# EAGLE schematic Full Schematic (EAGLE 6.5.0)
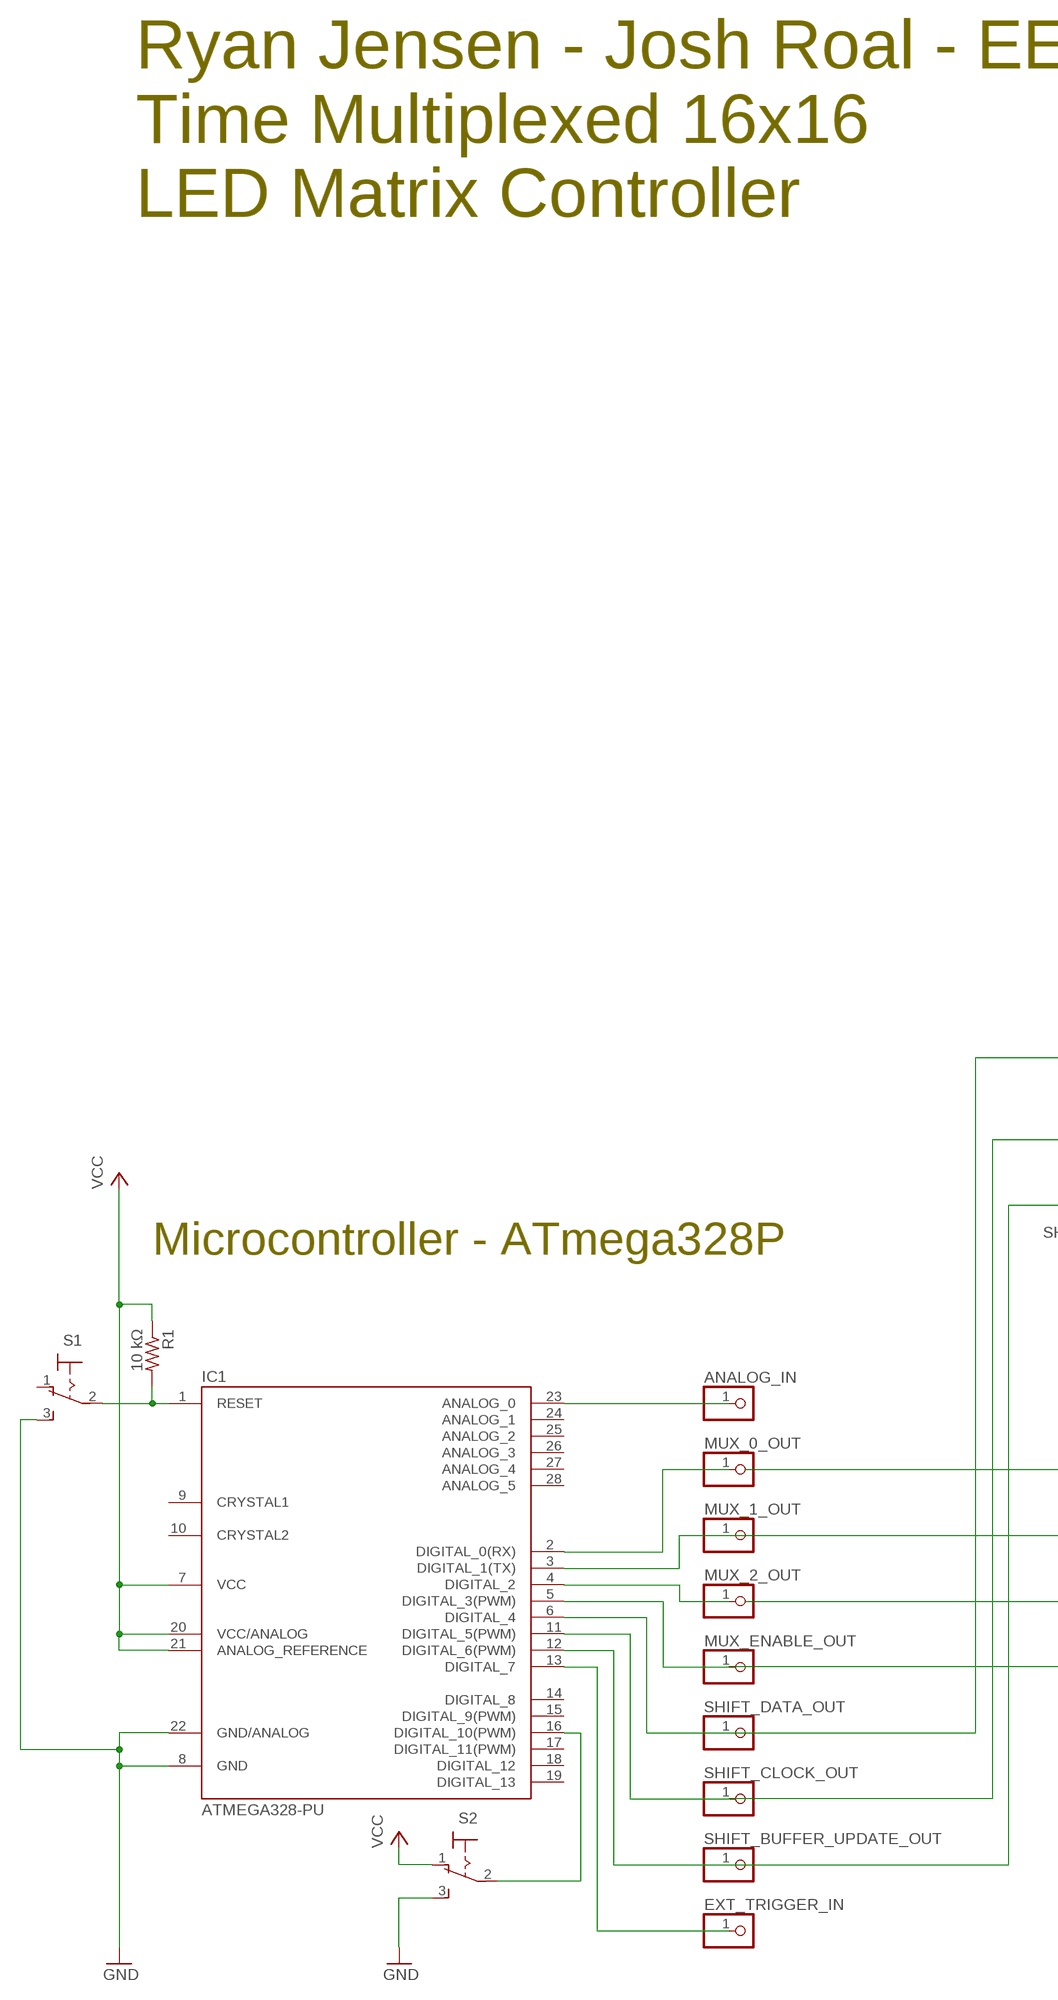
[diagram p0: schematic, sheet 1, part 1 of 3]
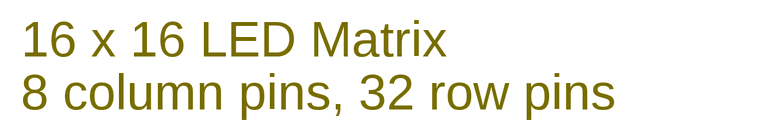
[diagram p1: schematic, sheet 1, part 2 of 3]
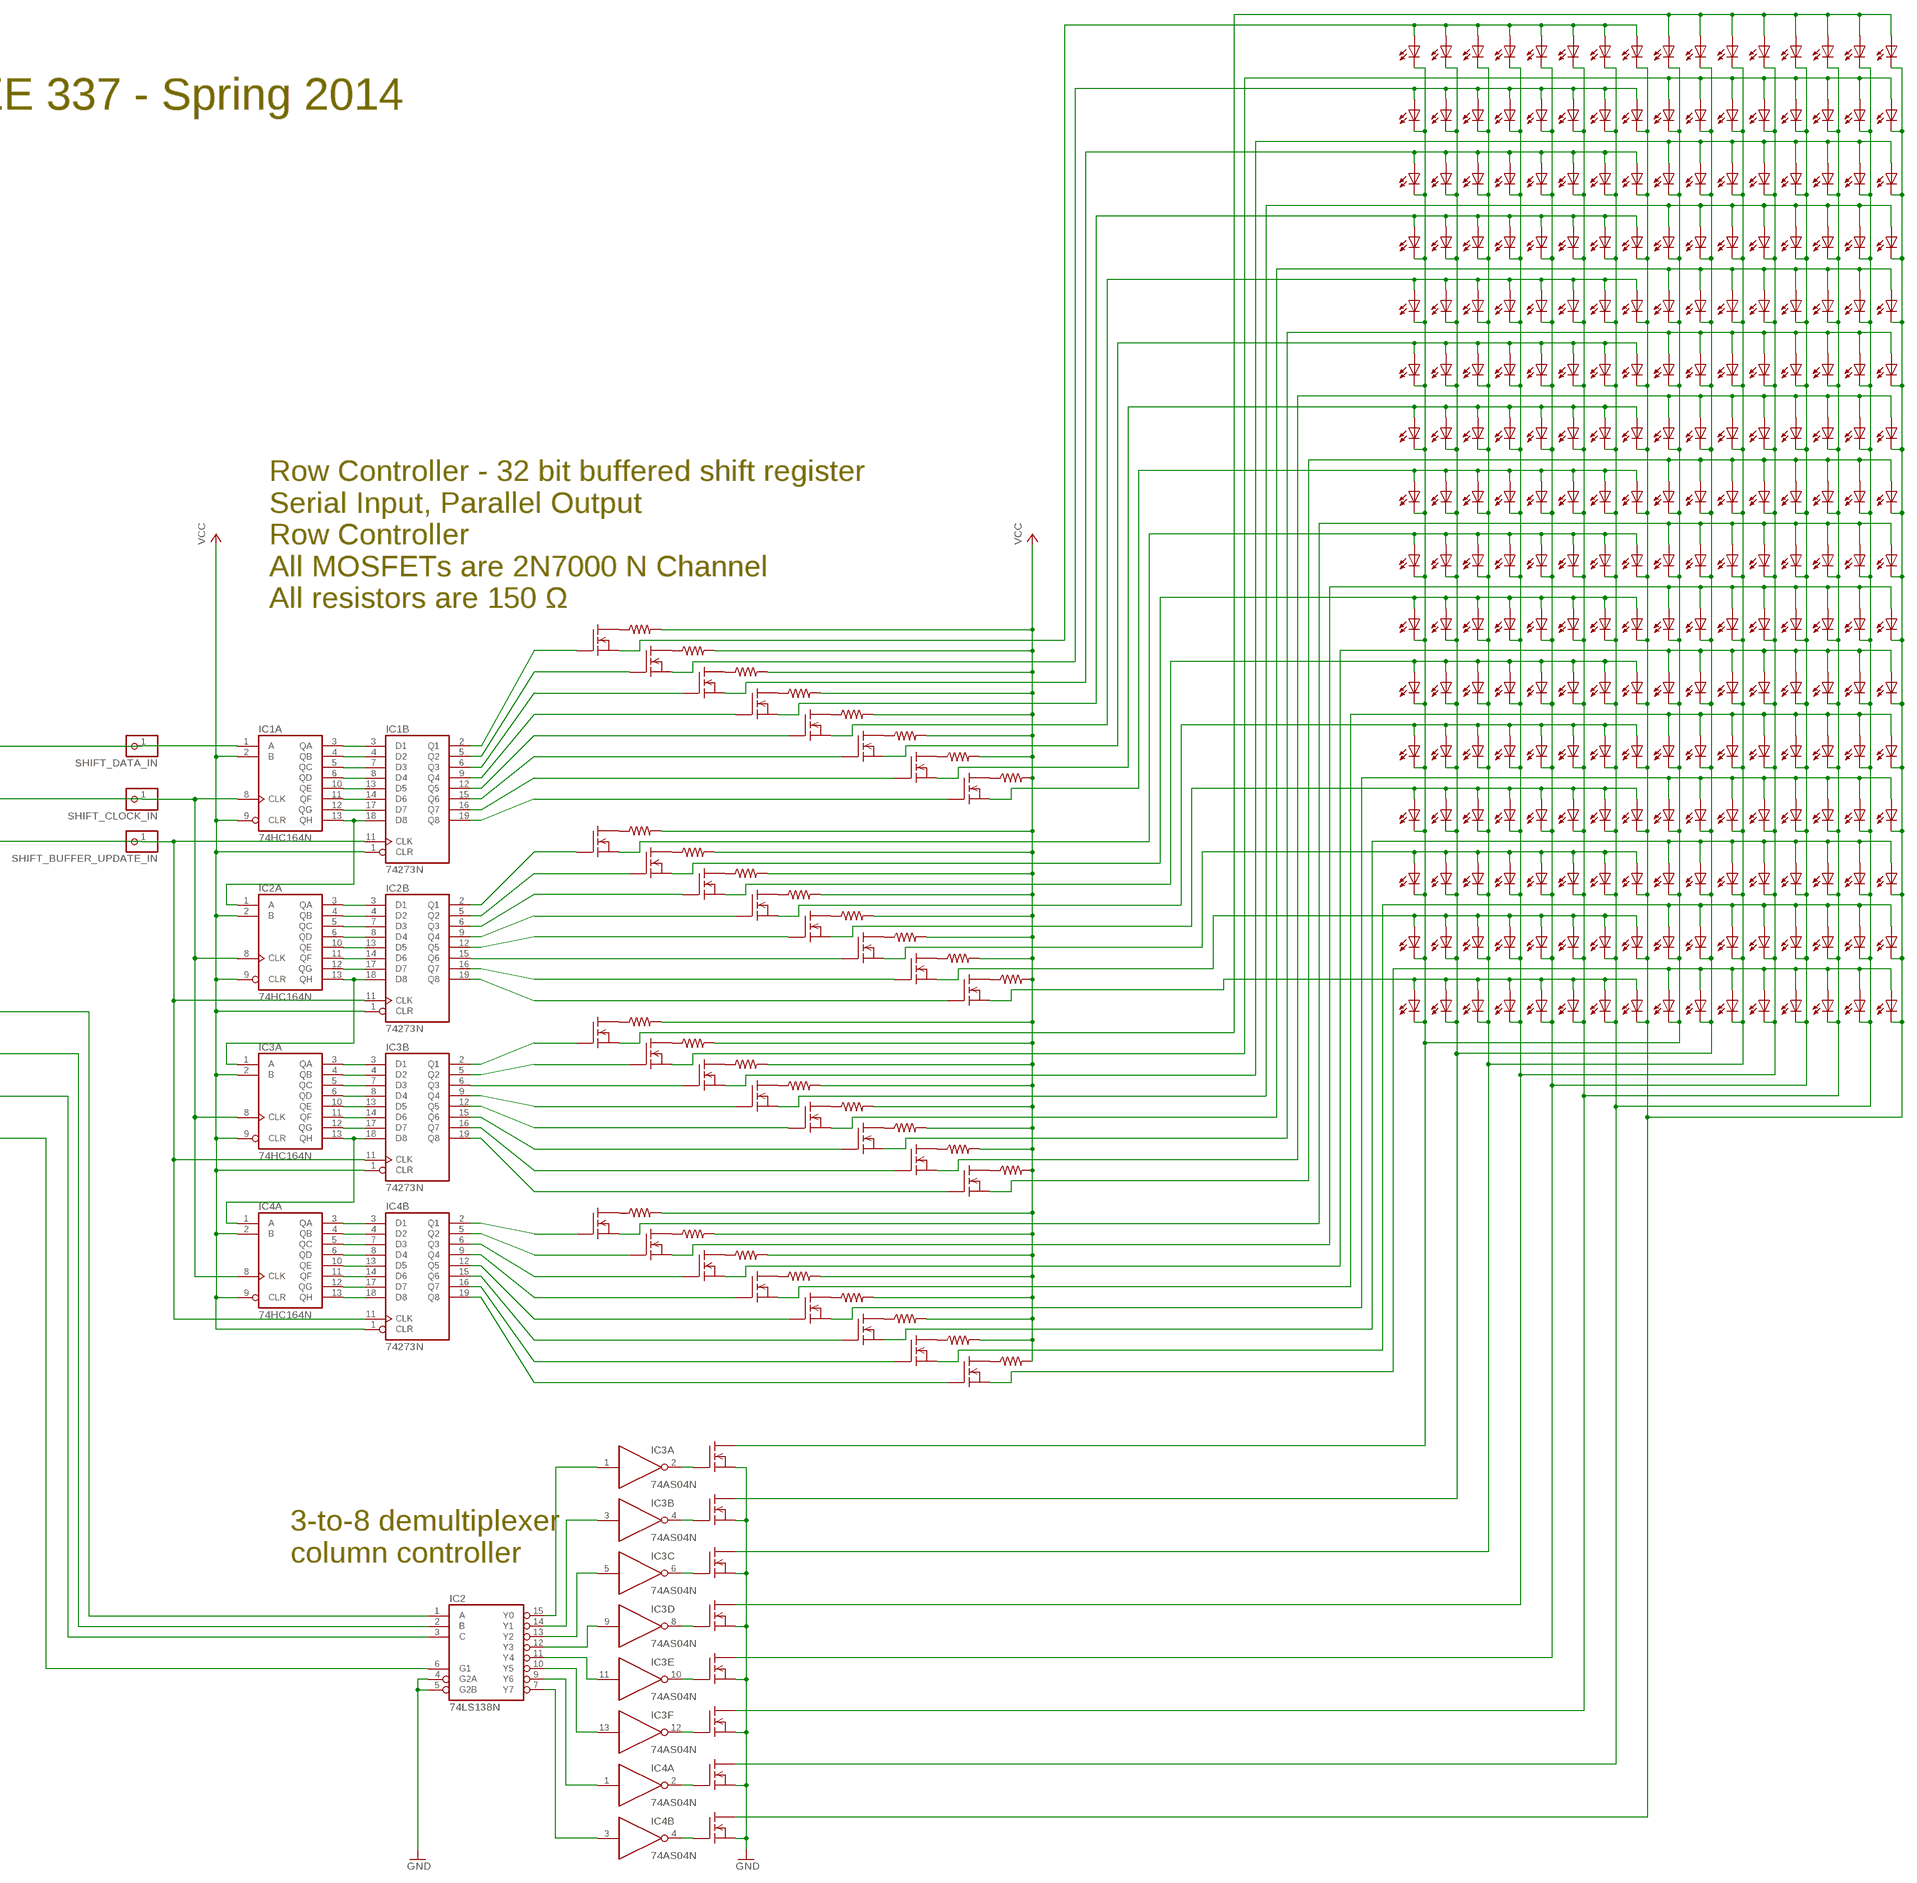
[diagram p2: schematic, sheet 1, part 3 of 3]

## Parts
ANALOG_IN  PINHD-1X1  [1X01]
EXT_TRIGGER_IN  PINHD-1X1  [1X01]
IC1  ATMEGA328-PU  ATMEGA168-PU  [DIL28-3]
IC1A  74HC164N  [DIL14]
IC1B  74273N  [DIL20]
IC2  74LS138N  [DIL16]
IC2A  74HC164N  [DIL14]
IC2B  74273N  [DIL20]
IC3  74AS04N  [DIL14]
IC3A  74HC164N  [DIL14]
IC3B  74273N  [DIL20]
IC4  74AS04N  [DIL14]
IC4A  74HC164N  [DIL14]
IC4B  74273N  [DIL20]
LED1  LED_ELD260  [LED_LD260]
LED2  LED_ELD260  [LED_LD260]
LED3  LED_ELD260  [LED_LD260]
LED4  LED_ELD260  [LED_LD260]
LED5  LED_ELD260  [LED_LD260]
LED6  LED_ELD260  [LED_LD260]
LED7  LED_ELD260  [LED_LD260]
LED8  LED_ELD260  [LED_LD260]
LED9  LED_ELD260  [LED_LD260]
LED10  LED_ELD260  [LED_LD260]
LED11  LED_ELD260  [LED_LD260]
LED12  LED_ELD260  [LED_LD260]
LED13  LED_ELD260  [LED_LD260]
LED14  LED_ELD260  [LED_LD260]
LED15  LED_ELD260  [LED_LD260]
LED16  LED_ELD260  [LED_LD260]
LED17  LED_ELD260  [LED_LD260]
LED18  LED_ELD260  [LED_LD260]
LED19  LED_ELD260  [LED_LD260]
LED20  LED_ELD260  [LED_LD260]
LED21  LED_ELD260  [LED_LD260]
LED22  LED_ELD260  [LED_LD260]
LED23  LED_ELD260  [LED_LD260]
LED24  LED_ELD260  [LED_LD260]
LED25  LED_ELD260  [LED_LD260]
LED26  LED_ELD260  [LED_LD260]
LED27  LED_ELD260  [LED_LD260]
LED28  LED_ELD260  [LED_LD260]
LED29  LED_ELD260  [LED_LD260]
LED30  LED_ELD260  [LED_LD260]
LED31  LED_ELD260  [LED_LD260]
LED32  LED_ELD260  [LED_LD260]
LED33  LED_ELD260  [LED_LD260]
LED34  LED_ELD260  [LED_LD260]
LED35  LED_ELD260  [LED_LD260]
LED36  LED_ELD260  [LED_LD260]
LED37  LED_ELD260  [LED_LD260]
LED38  LED_ELD260  [LED_LD260]
LED39  LED_ELD260  [LED_LD260]
LED40  LED_ELD260  [LED_LD260]
LED41  LED_ELD260  [LED_LD260]
LED42  LED_ELD260  [LED_LD260]
LED43  LED_ELD260  [LED_LD260]
LED44  LED_ELD260  [LED_LD260]
LED45  LED_ELD260  [LED_LD260]
LED46  LED_ELD260  [LED_LD260]
LED47  LED_ELD260  [LED_LD260]
LED48  LED_ELD260  [LED_LD260]
LED49  LED_ELD260  [LED_LD260]
LED50  LED_ELD260  [LED_LD260]
LED51  LED_ELD260  [LED_LD260]
LED52  LED_ELD260  [LED_LD260]
LED53  LED_ELD260  [LED_LD260]
LED54  LED_ELD260  [LED_LD260]
LED55  LED_ELD260  [LED_LD260]
LED56  LED_ELD260  [LED_LD260]
LED57  LED_ELD260  [LED_LD260]
LED58  LED_ELD260  [LED_LD260]
LED59  LED_ELD260  [LED_LD260]
LED60  LED_ELD260  [LED_LD260]
LED61  LED_ELD260  [LED_LD260]
LED62  LED_ELD260  [LED_LD260]
LED63  LED_ELD260  [LED_LD260]
LED64  LED_ELD260  [LED_LD260]
LED65  LED_ELD260  [LED_LD260]
LED66  LED_ELD260  [LED_LD260]
LED67  LED_ELD260  [LED_LD260]
LED68  LED_ELD260  [LED_LD260]
LED69  LED_ELD260  [LED_LD260]
LED70  LED_ELD260  [LED_LD260]
LED71  LED_ELD260  [LED_LD260]
LED72  LED_ELD260  [LED_LD260]
LED73  LED_ELD260  [LED_LD260]
LED74  LED_ELD260  [LED_LD260]
LED75  LED_ELD260  [LED_LD260]
LED76  LED_ELD260  [LED_LD260]
LED77  LED_ELD260  [LED_LD260]
LED78  LED_ELD260  [LED_LD260]
LED79  LED_ELD260  [LED_LD260]
LED80  LED_ELD260  [LED_LD260]
LED81  LED_ELD260  [LED_LD260]
LED82  LED_ELD260  [LED_LD260]
LED83  LED_ELD260  [LED_LD260]
LED84  LED_ELD260  [LED_LD260]
LED85  LED_ELD260  [LED_LD260]
LED86  LED_ELD260  [LED_LD260]
LED87  LED_ELD260  [LED_LD260]
LED88  LED_ELD260  [LED_LD260]
LED89  LED_ELD260  [LED_LD260]
LED90  LED_ELD260  [LED_LD260]
LED91  LED_ELD260  [LED_LD260]
LED92  LED_ELD260  [LED_LD260]
LED93  LED_ELD260  [LED_LD260]
LED94  LED_ELD260  [LED_LD260]
LED95  LED_ELD260  [LED_LD260]
LED96  LED_ELD260  [LED_LD260]
LED97  LED_ELD260  [LED_LD260]
LED98  LED_ELD260  [LED_LD260]
LED99  LED_ELD260  [LED_LD260]
LED100  LED_ELD260  [LED_LD260]
LED101  LED_ELD260  [LED_LD260]
LED102  LED_ELD260  [LED_LD260]
LED103  LED_ELD260  [LED_LD260]
LED104  LED_ELD260  [LED_LD260]
LED105  LED_ELD260  [LED_LD260]
LED106  LED_ELD260  [LED_LD260]
LED107  LED_ELD260  [LED_LD260]
LED108  LED_ELD260  [LED_LD260]
LED109  LED_ELD260  [LED_LD260]
LED110  LED_ELD260  [LED_LD260]
LED111  LED_ELD260  [LED_LD260]
LED112  LED_ELD260  [LED_LD260]
LED113  LED_ELD260  [LED_LD260]
LED114  LED_ELD260  [LED_LD260]
LED115  LED_ELD260  [LED_LD260]
LED116  LED_ELD260  [LED_LD260]
LED117  LED_ELD260  [LED_LD260]
LED118  LED_ELD260  [LED_LD260]
LED119  LED_ELD260  [LED_LD260]
LED120  LED_ELD260  [LED_LD260]
LED121  LED_ELD260  [LED_LD260]
LED122  LED_ELD260  [LED_LD260]
LED123  LED_ELD260  [LED_LD260]
LED124  LED_ELD260  [LED_LD260]
LED125  LED_ELD260  [LED_LD260]
LED126  LED_ELD260  [LED_LD260]
LED127  LED_ELD260  [LED_LD260]
LED128  LED_ELD260  [LED_LD260]
LED257  LED_ELD260  [LED_LD260]
LED258  LED_ELD260  [LED_LD260]
LED259  LED_ELD260  [LED_LD260]
LED260  LED_ELD260  [LED_LD260]
LED261  LED_ELD260  [LED_LD260]
LED262  LED_ELD260  [LED_LD260]
LED263  LED_ELD260  [LED_LD260]
LED264  LED_ELD260  [LED_LD260]
LED265  LED_ELD260  [LED_LD260]
LED266  LED_ELD260  [LED_LD260]
LED267  LED_ELD260  [LED_LD260]
LED268  LED_ELD260  [LED_LD260]
LED269  LED_ELD260  [LED_LD260]
LED270  LED_ELD260  [LED_LD260]
LED271  LED_ELD260  [LED_LD260]
LED272  LED_ELD260  [LED_LD260]
LED273  LED_ELD260  [LED_LD260]
LED274  LED_ELD260  [LED_LD260]
LED275  LED_ELD260  [LED_LD260]
LED276  LED_ELD260  [LED_LD260]
LED277  LED_ELD260  [LED_LD260]
LED278  LED_ELD260  [LED_LD260]
LED279  LED_ELD260  [LED_LD260]
LED280  LED_ELD260  [LED_LD260]
LED281  LED_ELD260  [LED_LD260]
LED282  LED_ELD260  [LED_LD260]
LED283  LED_ELD260  [LED_LD260]
LED284  LED_ELD260  [LED_LD260]
LED285  LED_ELD260  [LED_LD260]
LED286  LED_ELD260  [LED_LD260]
LED287  LED_ELD260  [LED_LD260]
LED288  LED_ELD260  [LED_LD260]
LED289  LED_ELD260  [LED_LD260]
LED290  LED_ELD260  [LED_LD260]
LED291  LED_ELD260  [LED_LD260]
LED292  LED_ELD260  [LED_LD260]
LED293  LED_ELD260  [LED_LD260]
LED294  LED_ELD260  [LED_LD260]
LED295  LED_ELD260  [LED_LD260]
LED296  LED_ELD260  [LED_LD260]
LED297  LED_ELD260  [LED_LD260]
LED298  LED_ELD260  [LED_LD260]
LED299  LED_ELD260  [LED_LD260]
LED300  LED_ELD260  [LED_LD260]
LED301  LED_ELD260  [LED_LD260]
LED302  LED_ELD260  [LED_LD260]
LED303  LED_ELD260  [LED_LD260]
LED304  LED_ELD260  [LED_LD260]
LED305  LED_ELD260  [LED_LD260]
LED306  LED_ELD260  [LED_LD260]
LED307  LED_ELD260  [LED_LD260]
LED308  LED_ELD260  [LED_LD260]
LED309  LED_ELD260  [LED_LD260]
LED310  LED_ELD260  [LED_LD260]
LED311  LED_ELD260  [LED_LD260]
LED312  LED_ELD260  [LED_LD260]
LED313  LED_ELD260  [LED_LD260]
LED314  LED_ELD260  [LED_LD260]
LED315  LED_ELD260  [LED_LD260]
LED316  LED_ELD260  [LED_LD260]
LED317  LED_ELD260  [LED_LD260]
LED318  LED_ELD260  [LED_LD260]
LED319  LED_ELD260  [LED_LD260]
LED320  LED_ELD260  [LED_LD260]
LED321  LED_ELD260  [LED_LD260]
LED322  LED_ELD260  [LED_LD260]
LED323  LED_ELD260  [LED_LD260]
LED324  LED_ELD260  [LED_LD260]
LED325  LED_ELD260  [LED_LD260]
LED326  LED_ELD260  [LED_LD260]
LED327  LED_ELD260  [LED_LD260]
LED328  LED_ELD260  [LED_LD260]
LED329  LED_ELD260  [LED_LD260]
LED330  LED_ELD260  [LED_LD260]
LED331  LED_ELD260  [LED_LD260]
LED332  LED_ELD260  [LED_LD260]
LED333  LED_ELD260  [LED_LD260]
LED334  LED_ELD260  [LED_LD260]
LED335  LED_ELD260  [LED_LD260]
LED336  LED_ELD260  [LED_LD260]
LED337  LED_ELD260  [LED_LD260]
LED338  LED_ELD260  [LED_LD260]
LED339  LED_ELD260  [LED_LD260]
LED340  LED_ELD260  [LED_LD260]
LED341  LED_ELD260  [LED_LD260]
LED342  LED_ELD260  [LED_LD260]
LED343  LED_ELD260  [LED_LD260]
LED344  LED_ELD260  [LED_LD260]
LED345  LED_ELD260  [LED_LD260]
LED346  LED_ELD260  [LED_LD260]
LED347  LED_ELD260  [LED_LD260]
LED348  LED_ELD260  [LED_LD260]
LED349  LED_ELD260  [LED_LD260]
LED350  LED_ELD260  [LED_LD260]
LED351  LED_ELD260  [LED_LD260]
LED352  LED_ELD260  [LED_LD260]
LED353  LED_ELD260  [LED_LD260]
LED354  LED_ELD260  [LED_LD260]
LED355  LED_ELD260  [LED_LD260]
LED356  LED_ELD260  [LED_LD260]
LED357  LED_ELD260  [LED_LD260]
LED358  LED_ELD260  [LED_LD260]
LED359  LED_ELD260  [LED_LD260]
LED360  LED_ELD260  [LED_LD260]
LED361  LED_ELD260  [LED_LD260]
LED362  LED_ELD260  [LED_LD260]
LED363  LED_ELD260  [LED_LD260]
LED364  LED_ELD260  [LED_LD260]
LED365  LED_ELD260  [LED_LD260]
LED366  LED_ELD260  [LED_LD260]
LED367  LED_ELD260  [LED_LD260]
LED368  LED_ELD260  [LED_LD260]
LED369  LED_ELD260  [LED_LD260]
LED370  LED_ELD260  [LED_LD260]
LED371  LED_ELD260  [LED_LD260]
LED372  LED_ELD260  [LED_LD260]
LED373  LED_ELD260  [LED_LD260]
LED374  LED_ELD260  [LED_LD260]
LED375  LED_ELD260  [LED_LD260]
LED376  LED_ELD260  [LED_LD260]
LED377  LED_ELD260  [LED_LD260]
LED378  LED_ELD260  [LED_LD260]
LED379  LED_ELD260  [LED_LD260]
LED380  LED_ELD260  [LED_LD260]
LED381  LED_ELD260  [LED_LD260]
LED382  LED_ELD260  [LED_LD260]
LED383  LED_ELD260  [LED_LD260]
LED384  LED_ELD260  [LED_LD260]
MUX_0_OUT  PINHD-1X1  [1X01]
MUX_1_OUT  PINHD-1X1  [1X01]
MUX_2_OUT  PINHD-1X1  [1X01]
MUX_ENABLE_OUT  PINHD-1X1  [1X01]
Q1  2N7000  VN10KM  [TO237]
Q2  2N7000  VN10KM  [TO237]
Q3  2N7000  VN10KM  [TO237]
Q4  2N7000  VN10KM  [TO237]
Q5  2N7000  VN10KM  [TO237]
Q6  2N7000  VN10KM  [TO237]
Q7  2N7000  VN10KM  [TO237]
Q8  2N7000  VN10KM  [TO237]
Q9  2N7000  VN10KM  [TO237]
Q10  2N7000  VN10KM  [TO237]
Q11  2N7000  VN10KM  [TO237]
Q12  2N7000  VN10KM  [TO237]
Q13  2N7000  VN10KM  [TO237]
Q14  2N7000  VN10KM  [TO237]
Q15  2N7000  VN10KM  [TO237]
Q16  2N7000  VN10KM  [TO237]
Q17  2N7000  VN10KM  [TO237]
Q18  2N7000  VN10KM  [TO237]
Q19  2N7000  VN10KM  [TO237]
Q20  2N7000  VN10KM  [TO237]
Q21  2N7000  VN10KM  [TO237]
Q22  2N7000  VN10KM  [TO237]
Q23  2N7000  VN10KM  [TO237]
Q24  2N7000  VN10KM  [TO237]
Q25  2N7000  VN10KM  [TO237]
Q26  2N7000  VN10KM  [TO237]
Q27  2N7000  VN10KM  [TO237]
Q28  2N7000  VN10KM  [TO237]
Q29  2N7000  VN10KM  [TO237]
Q30  2N7000  VN10KM  [TO237]
Q31  2N7000  VN10KM  [TO237]
Q32  2N7000  VN10KM  [TO237]
Q33  2N7000  VN10KM  [TO237]
Q34  2N7000  VN10KM  [TO237]
Q35  2N7000  VN10KM  [TO237]
Q36  2N7000  VN10KM  [TO237]
Q37  2N7000  VN10KM  [TO237]
Q38  2N7000  VN10KM  [TO237]
Q39  2N7000  VN10KM  [TO237]
Q40  2N7000  VN10KM  [TO237]
R1  10 kΩ  R-US_0204/7  [0204/7]
R26  150 Ω  R-US_0204/7  [0204/7]
R27  150 Ω  R-US_0204/7  [0204/7]
R28  150 Ω  R-US_0204/7  [0204/7]
R29  150 Ω  R-US_0204/7  [0204/7]
R30  150 Ω  R-US_0204/7  [0204/7]
R31  150 Ω  R-US_0204/7  [0204/7]
R32  150 Ω  R-US_0204/7  [0204/7]
R33  150 Ω  R-US_0204/7  [0204/7]
R34  150 Ω  R-US_0204/7  [0204/7]
R35  150 Ω  R-US_0204/7  [0204/7]
R36  150 Ω  R-US_0204/7  [0204/7]
R37  150 Ω  R-US_0204/7  [0204/7]
R38  150 Ω  R-US_0204/7  [0204/7]
R39  150 Ω  R-US_0204/7  [0204/7]
R40  150 Ω  R-US_0204/7  [0204/7]
R41  150 Ω  R-US_0204/7  [0204/7]
R42  150 Ω  R-US_0204/7  [0204/7]
R43  150 Ω  R-US_0204/7  [0204/7]
R44  150 Ω  R-US_0204/7  [0204/7]
R45  150 Ω  R-US_0204/7  [0204/7]
R46  150 Ω  R-US_0204/7  [0204/7]
R47  150 Ω  R-US_0204/7  [0204/7]
R48  150 Ω  R-US_0204/7  [0204/7]
R49  150 Ω  R-US_0204/7  [0204/7]
R50  150 Ω  R-US_0204/7  [0204/7]
R51  150 Ω  R-US_0204/7  [0204/7]
R52  150 Ω  R-US_0204/7  [0204/7]
R53  150 Ω  R-US_0204/7  [0204/7]
R54  150 Ω  R-US_0204/7  [0204/7]
R55  150 Ω  R-US_0204/7  [0204/7]
R56  150 Ω  R-US_0204/7  [0204/7]
R57  150 Ω  R-US_0204/7  [0204/7]
S1  M9040P  [M9040P]
S2  M9040P  [M9040P]
SHIFT_BUFFER_UPDATE_IN  PINHD-1X1  [1X01]
SHIFT_BUFFER_UPDATE_OUT  PINHD-1X1  [1X01]
SHIFT_CLOCK_IN  PINHD-1X1  [1X01]
SHIFT_CLOCK_OUT  PINHD-1X1  [1X01]
SHIFT_DATA_IN  PINHD-1X1  [1X01]
SHIFT_DATA_OUT  PINHD-1X1  [1X01]

## Nets
GND: IC1.8(GND) IC1.22(GND/ANALOG) IC2.4(G2A) IC2.5(G2B) Q33.3(S) Q34.3(S) Q35.3(S) Q36.3(S) Q37.3(S) Q38.3(S) Q39.3(S) Q40.3(S) S1.3(S) S2.3(S)
N$1: IC1B.2(Q1) Q1.2(G)
N$2: IC1B.5(Q2) Q2.2(G)
N$3: IC1B.6(Q3) Q3.2(G)
N$4: IC1B.9(Q4) Q4.2(G)
N$5: IC1B.12(Q5) Q5.2(G)
N$6: IC1B.15(Q6) Q6.2(G)
N$7: IC1B.16(Q7) Q7.2(G)
N$8: IC1B.19(Q8) Q8.2(G)
N$9: IC2B.2(Q1) Q9.2(G)
N$10: IC2B.5(Q2) Q10.2(G)
N$11: IC2B.6(Q3) Q11.2(G)
N$12: IC2B.9(Q4) Q12.2(G)
N$13: IC2B.12(Q5) Q13.2(G)
N$14: IC2B.15(Q6) Q14.2(G)
N$15: IC2B.16(Q7) Q15.2(G)
N$16: IC2B.19(Q8) Q16.2(G)
N$17: IC3B.2(Q1) Q17.2(G)
N$18: IC3B.5(Q2) Q18.2(G)
N$19: IC3B.6(Q3) Q19.2(G)
N$20: IC3B.9(Q4) Q20.2(G)
N$21: IC3B.12(Q5) Q21.2(G)
N$22: IC3B.15(Q6) Q22.2(G)
N$23: IC3B.16(Q7) Q23.2(G)
N$24: IC3B.19(Q8) Q24.2(G)
N$25: IC4B.2(Q1) Q25.2(G)
N$26: IC4B.5(Q2) Q26.2(G)
N$27: IC4B.6(Q3) Q27.2(G)
N$28: IC4B.9(Q4) Q28.2(G)
N$29: IC4B.12(Q5) Q29.2(G)
N$30: IC4B.15(Q6) Q30.2(G)
N$31: IC4B.16(Q7) Q31.2(G)
N$32: IC4B.19(Q8) Q32.2(G)
N$33: IC1A.3(QA) IC1B.3(D1)
N$34: IC1A.4(QB) IC1B.4(D2)
N$35: IC1A.5(QC) IC1B.7(D3)
N$36: IC1A.6(QD) IC1B.8(D4)
N$37: IC1A.10(QE) IC1B.13(D5)
N$38: IC1A.11(QF) IC1B.14(D6)
N$39: IC1A.12(QG) IC1B.17(D7)
N$40: IC1A.13(QH) IC1B.18(D8) IC2A.1(A)
N$41: IC2A.3(QA) IC2B.3(D1)
N$42: IC2A.4(QB) IC2B.4(D2)
N$43: IC2A.5(QC) IC2B.7(D3)
N$44: IC2A.6(QD) IC2B.8(D4)
N$45: IC2A.10(QE) IC2B.13(D5)
N$46: IC2A.11(QF) IC2B.14(D6)
N$47: ANALOG_IN.1 IC1.23(ANALOG_0)
N$48: IC2A.13(QH) IC2B.18(D8) IC3A.1(A)
N$49: IC3A.3(QA) IC3B.3(D1)
N$50: IC3A.4(QB) IC3B.4(D2)
N$51: IC3A.5(QC) IC3B.7(D3)
N$52: IC3A.6(QD) IC3B.8(D4)
N$53: IC3A.10(QE) IC3B.13(D5)
N$54: IC3A.11(QF) IC3B.14(D6)
N$55: IC3A.12(QG) IC3B.17(D7)
N$56: IC3A.13(QH) IC3B.18(D8) IC4A.1(A)
N$57: IC4A.3(QA) IC4B.3(D1)
N$58: IC4A.4(QB) IC4B.4(D2)
N$59: IC4A.5(QC) IC4B.7(D3)
N$60: IC4A.6(QD) IC4B.8(D4)
N$61: IC4A.10(QE) IC4B.13(D5)
N$62: IC4A.11(QF) IC4B.14(D6)
N$63: IC4A.12(QG) IC4B.17(D7)
N$64: IC4A.13(QH) IC4B.18(D8)
N$65: IC1.1(RESET) R1.2 S1.2(P)
N$66: IC1.2(DIGITAL_0(RX)) MUX_0_OUT.1
N$67: IC1.3(DIGITAL_1(TX)) IC2.2(B) MUX_1_OUT.1
N$68: IC1.4(DIGITAL_2) MUX_2_OUT.1
N$69: IC1.5(DIGITAL_3(PWM)) IC2.6(G1) MUX_ENABLE_OUT.1
N$70: IC1.12(DIGITAL_6(PWM)) IC1B.11(CLK) IC2B.11(CLK) IC3B.11(CLK) IC4B.11(CLK) SHIFT_BUFFER_UPDATE_IN.1 SHIFT_BUFFER_UPDATE_OUT.1
N$71: IC1.6(DIGITAL_4) IC1A.1(A) SHIFT_DATA_IN.1 SHIFT_DATA_OUT.1
N$72: IC2.1(A)
N$73: IC2.3(C)
N$74: LED8.K(C) LED16.K(C) LED24.K(C) LED32.K(C) LED40.K(C) LED48.K(C) LED56.K(C) LED64.K(C) LED72.K(C) LED80.K(C) LED88.K(C) LED96.K(C) LED104.K(C) LED112.K(C) LED120.K(C) LED128.K(C) LED264.K(C) LED272.K(C) LED280.K(C) LED288.K(C) LED296.K(C) LED304.K(C) LED312.K(C) LED320.K(C) LED328.K(C) LED336.K(C) LED344.K(C) LED352.K(C) LED360.K(C) LED368.K(C) LED376.K(C) LED384.K(C) Q40.1(D)
N$75: IC1.16(DIGITAL_10(PWM)) S2.2(P)
N$76: IC1.11(DIGITAL_5(PWM)) IC1A.8(CLK) IC2A.8(CLK) IC3A.8(CLK) IC4A.8(CLK) SHIFT_CLOCK_IN.1 SHIFT_CLOCK_OUT.1
N$77: EXT_TRIGGER_IN.1 IC1.13(DIGITAL_7)
N$78: LED2.K(C) LED10.K(C) LED18.K(C) LED26.K(C) LED34.K(C) LED42.K(C) LED50.K(C) LED58.K(C) LED66.K(C) LED74.K(C) LED82.K(C) LED90.K(C) LED98.K(C) LED106.K(C) LED114.K(C) LED122.K(C) LED258.K(C) LED266.K(C) LED274.K(C) LED282.K(C) LED290.K(C) LED298.K(C) LED306.K(C) LED314.K(C) LED322.K(C) LED330.K(C) LED338.K(C) LED346.K(C) LED354.K(C) LED362.K(C) LED370.K(C) LED378.K(C) Q34.1(D)
N$79: LED3.K(C) LED11.K(C) LED19.K(C) LED27.K(C) LED35.K(C) LED43.K(C) LED51.K(C) LED59.K(C) LED67.K(C) LED75.K(C) LED83.K(C) LED91.K(C) LED99.K(C) LED107.K(C) LED115.K(C) LED123.K(C) LED259.K(C) LED267.K(C) LED275.K(C) LED283.K(C) LED291.K(C) LED299.K(C) LED307.K(C) LED315.K(C) LED323.K(C) LED331.K(C) LED339.K(C) LED347.K(C) LED355.K(C) LED363.K(C) LED371.K(C) LED379.K(C) Q35.1(D)
N$80: LED4.K(C) LED12.K(C) LED20.K(C) LED28.K(C) LED36.K(C) LED44.K(C) LED52.K(C) LED60.K(C) LED68.K(C) LED76.K(C) LED84.K(C) LED92.K(C) LED100.K(C) LED108.K(C) LED116.K(C) LED124.K(C) LED260.K(C) LED268.K(C) LED276.K(C) LED284.K(C) LED292.K(C) LED300.K(C) LED308.K(C) LED316.K(C) LED324.K(C) LED332.K(C) LED340.K(C) LED348.K(C) LED356.K(C) LED364.K(C) LED372.K(C) LED380.K(C) Q36.1(D)
N$81: LED5.K(C) LED13.K(C) LED21.K(C) LED29.K(C) LED37.K(C) LED45.K(C) LED53.K(C) LED61.K(C) LED69.K(C) LED77.K(C) LED85.K(C) LED93.K(C) LED101.K(C) LED109.K(C) LED117.K(C) LED125.K(C) LED261.K(C) LED269.K(C) LED277.K(C) LED285.K(C) LED293.K(C) LED301.K(C) LED309.K(C) LED317.K(C) LED325.K(C) LED333.K(C) LED341.K(C) LED349.K(C) LED357.K(C) LED365.K(C) LED373.K(C) LED381.K(C) Q37.1(D)
N$82: LED6.K(C) LED14.K(C) LED22.K(C) LED30.K(C) LED38.K(C) LED46.K(C) LED54.K(C) LED62.K(C) LED70.K(C) LED78.K(C) LED86.K(C) LED94.K(C) LED102.K(C) LED110.K(C) LED118.K(C) LED126.K(C) LED262.K(C) LED270.K(C) LED278.K(C) LED286.K(C) LED294.K(C) LED302.K(C) LED310.K(C) LED318.K(C) LED326.K(C) LED334.K(C) LED342.K(C) LED350.K(C) LED358.K(C) LED366.K(C) LED374.K(C) LED382.K(C) Q38.1(D)
N$84: LED1.K(C) LED9.K(C) LED17.K(C) LED25.K(C) LED33.K(C) LED41.K(C) LED49.K(C) LED57.K(C) LED65.K(C) LED73.K(C) LED81.K(C) LED89.K(C) LED97.K(C) LED105.K(C) LED113.K(C) LED121.K(C) LED257.K(C) LED265.K(C) LED273.K(C) LED281.K(C) LED289.K(C) LED297.K(C) LED305.K(C) LED313.K(C) LED321.K(C) LED329.K(C) LED337.K(C) LED345.K(C) LED353.K(C) LED361.K(C) LED369.K(C) LED377.K(C) Q33.1(D)
N$85: IC2A.12(QG) IC2B.17(D7)
N$86: LED273.A LED274.A LED275.A LED276.A LED277.A LED278.A LED279.A LED280.A
N$87: LED265.A LED266.A LED267.A LED268.A LED269.A LED270.A LED271.A LED272.A
N$88: LED257.A LED258.A LED259.A LED260.A LED261.A LED262.A LED263.A LED264.A
N$89: LED281.A LED282.A LED283.A LED284.A LED285.A LED286.A LED287.A LED288.A
N$90: LED289.A LED290.A LED291.A LED292.A LED293.A LED294.A LED295.A LED296.A
N$91: LED297.A LED298.A LED299.A LED300.A LED301.A LED302.A LED303.A LED304.A
N$92: LED305.A LED306.A LED307.A LED308.A LED309.A LED310.A LED311.A LED312.A
N$93: LED313.A LED314.A LED315.A LED316.A LED317.A LED318.A LED319.A LED320.A
N$118: IC2.12(Y3) IC3.9(D:I)
N$126: IC2.11(Y4) IC3.11(E:I)
N$127: IC2.13(Y2) IC3.5(C:I)
N$128: IC2.14(Y1) IC3.3(B:I)
N$129: IC2.15(Y0) IC3.1(A:I)
N$130: IC2.10(Y5) IC3.13(F:I)
N$131: IC2.9(Y6) IC4.1(A:I)
N$132: IC2.7(Y7) IC4.3(B:I)
N$142: IC3.2(A:O) Q33.2(G)
N$143: IC3.4(B:O) Q34.2(G)
N$144: IC3.6(C:O) Q35.2(G)
N$145: IC3.8(D:O) Q36.2(G)
N$146: IC3.10(E:O) Q37.2(G)
N$147: IC3.12(F:O) Q38.2(G)
N$148: IC4.2(A:O) Q39.2(G)
N$149: IC4.4(B:O) Q40.2(G)
N$175: LED17.A LED18.A LED19.A LED20.A LED21.A LED22.A LED23.A LED24.A Q3.3(S)
N$183: LED9.A LED10.A LED11.A LED12.A LED13.A LED14.A LED15.A LED16.A Q2.3(S)
N$184: LED1.A LED2.A LED3.A LED4.A LED5.A LED6.A LED7.A LED8.A Q1.3(S)
N$186: LED321.A LED322.A LED323.A LED324.A LED325.A LED326.A LED327.A LED328.A
N$187: LED361.A LED362.A LED363.A LED364.A LED365.A LED366.A LED367.A LED368.A
N$188: LED369.A LED370.A LED371.A LED372.A LED373.A LED374.A LED375.A LED376.A
N$189: LED377.A LED378.A LED379.A LED380.A LED381.A LED382.A LED383.A LED384.A
N$190: LED329.A LED330.A LED331.A LED332.A LED333.A LED334.A LED335.A LED336.A
N$191: LED337.A LED338.A LED339.A LED340.A LED341.A LED342.A LED343.A LED344.A
N$192: LED25.A LED26.A LED27.A LED28.A LED29.A LED30.A LED31.A LED32.A Q4.3(S)
N$193: LED33.A LED34.A LED35.A LED36.A LED37.A LED38.A LED39.A LED40.A Q5.3(S)
N$194: LED41.A LED42.A LED43.A LED44.A LED45.A LED46.A LED47.A LED48.A Q6.3(S)
N$195: LED49.A LED50.A LED51.A LED52.A LED53.A LED54.A LED55.A LED56.A Q7.3(S)
N$196: LED57.A LED58.A LED59.A LED60.A LED61.A LED62.A LED63.A LED64.A Q8.3(S)
N$197: LED65.A LED66.A LED67.A LED68.A LED69.A LED70.A LED71.A LED72.A Q9.3(S)
N$198: LED105.A LED106.A LED107.A LED108.A LED109.A LED110.A LED111.A LED112.A Q14.3(S)
N$199: LED113.A LED114.A LED115.A LED116.A LED117.A LED118.A LED119.A LED120.A Q15.3(S)
N$200: LED121.A LED122.A LED123.A LED124.A LED125.A LED126.A LED127.A LED128.A Q16.3(S)
N$201: LED345.A LED346.A LED347.A LED348.A LED349.A LED350.A LED351.A LED352.A
N$202: LED353.A LED354.A LED355.A LED356.A LED357.A LED358.A LED359.A LED360.A
N$206: LED73.A LED74.A LED75.A LED76.A LED77.A LED78.A LED79.A LED80.A Q10.3(S)
N$207: LED81.A LED82.A LED83.A LED84.A LED85.A LED86.A LED87.A LED88.A Q11.3(S)
N$208: LED89.A LED90.A LED91.A LED92.A LED93.A LED94.A LED95.A LED96.A Q12.3(S)
N$209: LED97.A LED98.A LED99.A LED100.A LED101.A LED102.A LED103.A LED104.A Q13.3(S)
N$231: LED7.K(C) LED15.K(C) LED23.K(C) LED31.K(C) LED39.K(C) LED47.K(C) LED55.K(C) LED63.K(C) LED71.K(C) LED79.K(C) LED87.K(C) LED95.K(C) LED103.K(C) LED111.K(C) LED119.K(C) LED127.K(C) LED263.K(C) LED271.K(C) LED279.K(C) LED287.K(C) LED295.K(C) LED303.K(C) LED311.K(C) LED319.K(C) LED327.K(C) LED335.K(C) LED343.K(C) LED351.K(C) LED359.K(C) LED367.K(C) LED375.K(C) LED383.K(C) Q39.1(D)
VCC: IC1.7(VCC) IC1.20(VCC/ANALOG) IC1.21(ANALOG_REFERENCE) IC1A.2(B) IC1A.9(CLR) IC1B.1(CLR) IC2A.2(B) IC2A.9(CLR) IC2B.1(CLR) IC3A.2(B) IC3A.9(CLR) IC3B.1(CLR) IC4A.2(B) IC4A.9(CLR) IC4B.1(CLR) R1.1 R26.2 R27.2 R28.2 R29.2 R30.2 R31.2 R32.2 R33.2 R34.2 R35.2 R36.2 R37.2 R38.2 R39.2 R40.2 R41.2 R42.2 R43.2 R44.2 R45.2 R46.2 R47.2 R48.2 R49.2 R50.2 R51.2 R52.2 R53.2 R54.2 R55.2 R57.2 S2.1(O)
Unconnected: IC1.9(CRYSTAL1) IC1.10(CRYSTAL2) IC1.14(DIGITAL_8) IC1.15(DIGITAL_9(PWM)) IC1.17(DIGITAL_11(PWM)) IC1.18(DIGITAL_12) IC1.19(DIGITAL_13) IC1.24(ANALOG_1) IC1.25(ANALOG_2) IC1.26(ANALOG_3) IC1.27(ANALOG_4) IC1.28(ANALOG_5) IC4.5(C:I) IC4.6(C:O) IC4.8(D:O) IC4.9(D:I) IC4.10(E:O) IC4.11(E:I) IC4.12(F:O) IC4.13(F:I) Q1.1(D) Q2.1(D) Q3.1(D) Q4.1(D) Q5.1(D) Q6.1(D) Q7.1(D) Q8.1(D) Q9.1(D) Q10.1(D) Q11.1(D) Q12.1(D) Q13.1(D) Q14.1(D) Q15.1(D) Q16.1(D) Q17.1(D) Q17.3(S) Q18.1(D) Q18.3(S) Q19.1(D) Q19.3(S) Q20.1(D) Q20.3(S) Q21.1(D) Q21.3(S) Q22.1(D) Q22.3(S) Q23.1(D) Q23.3(S) Q24.1(D) Q24.3(S) Q25.1(D) Q25.3(S) Q26.1(D) Q26.3(S) Q27.1(D) Q27.3(S) Q28.1(D) Q28.3(S) Q29.1(D) Q29.3(S) Q30.1(D) Q30.3(S) Q31.1(D) Q31.3(S) Q32.1(D) Q32.3(S) R26.1 R27.1 R28.1 R29.1 R30.1 R31.1 R32.1 R33.1 R34.1 R35.1 R36.1 R37.1 R38.1 R39.1 R40.1 R41.1 R42.1 R43.1 R44.1 R45.1 R46.1 R47.1 R48.1 R49.1 R50.1 R51.1 R52.1 R53.1 R54.1 R55.1 R56.1 R56.2 R57.1 S1.1(O)

## Notes on the sheet
- 16 x 16 LED Matrix
  8 column pins, 32 row pins
- Ryan Jensen - Josh Roal - EE 337 - Spring 2014
  Time Multiplexed 16x16
  LED Matrix Controller
- Row Controller - 32 bit buffered shift register
  Serial Input, Parallel Output
  Row Controller
  All MOSFETs are 2N7000 N Channel
  All resistors are 150 Ω
- Microcontroller - ATmega328P
- 3-to-8 demultiplexer
  column controller

## Power pins joined to a net without a drawn wire
GND: IC1A.7(GND) IC1B.10(GND) IC2.8(GND) IC2A.7(GND) IC2B.10(GND) IC3.7(P:GND) IC3A.7(GND) IC3B.10(GND) IC4.7(P:GND) IC4A.7(GND) IC4B.10(GND)
VCC: IC1A.14(VCC) IC1B.20(VCC) IC2.16(VCC) IC2A.14(VCC) IC2B.20(VCC) IC3.14(P:VCC) IC3A.14(VCC) IC3B.20(VCC) IC4.14(P:VCC) IC4A.14(VCC) IC4B.20(VCC)

## Library data of the parts
ANALOG_IN EXT_TRIGGER_IN MUX_0_OUT MUX_1_OUT MUX_2_OUT MUX_ENABLE_OUT SHIFT_BUFFER_UPDATE_IN SHIFT_BUFFER_UPDATE_OUT SHIFT_CLOCK_IN SHIFT_CLOCK_OUT SHIFT_DATA_IN SHIFT_DATA_OUT = pinhead:PINHD-1X1: PIN HEADER
IC1 = Arduino-AVR:ATMEGA168-PU
IC1A IC2A IC3A IC4A = 74xx-us:74*164: 8-bit parallel out SHIFT REGISTER
IC1B IC2B IC3B IC4B = 74xx-us:74*273: Octal D type FLIP FLOP, clear
IC2 = 74xx-us:74*138: 3-line to 8-line DECODER/DEMULTIPLEXER
IC3 IC4 = 74xx-us:74*04: Hex INVERTER
LED1-LED128 LED257-LED384 = eagle-ltspice:LED_E: LED Source: http://www.osram.convergy.de Source: www.luxeon.com Source: www.kingbright.com; SPICEMODEL: NONE; SPICEPREFIX: D; SPICETYPE: diode
Q1-Q40 = transistor-fet:VN10KM: N-Channel Enhancement MOSFET (VMOS); 60V; 0,5A; 5,0Ohm
R1 R26-R57 = resistor:R-US_: RESISTOR, American symbol
S1 S2 = switch:M9040P: TOGGLE SWITCH Marquardt